# Altium schematic sheet Sheet_2.SchDoc
size A3
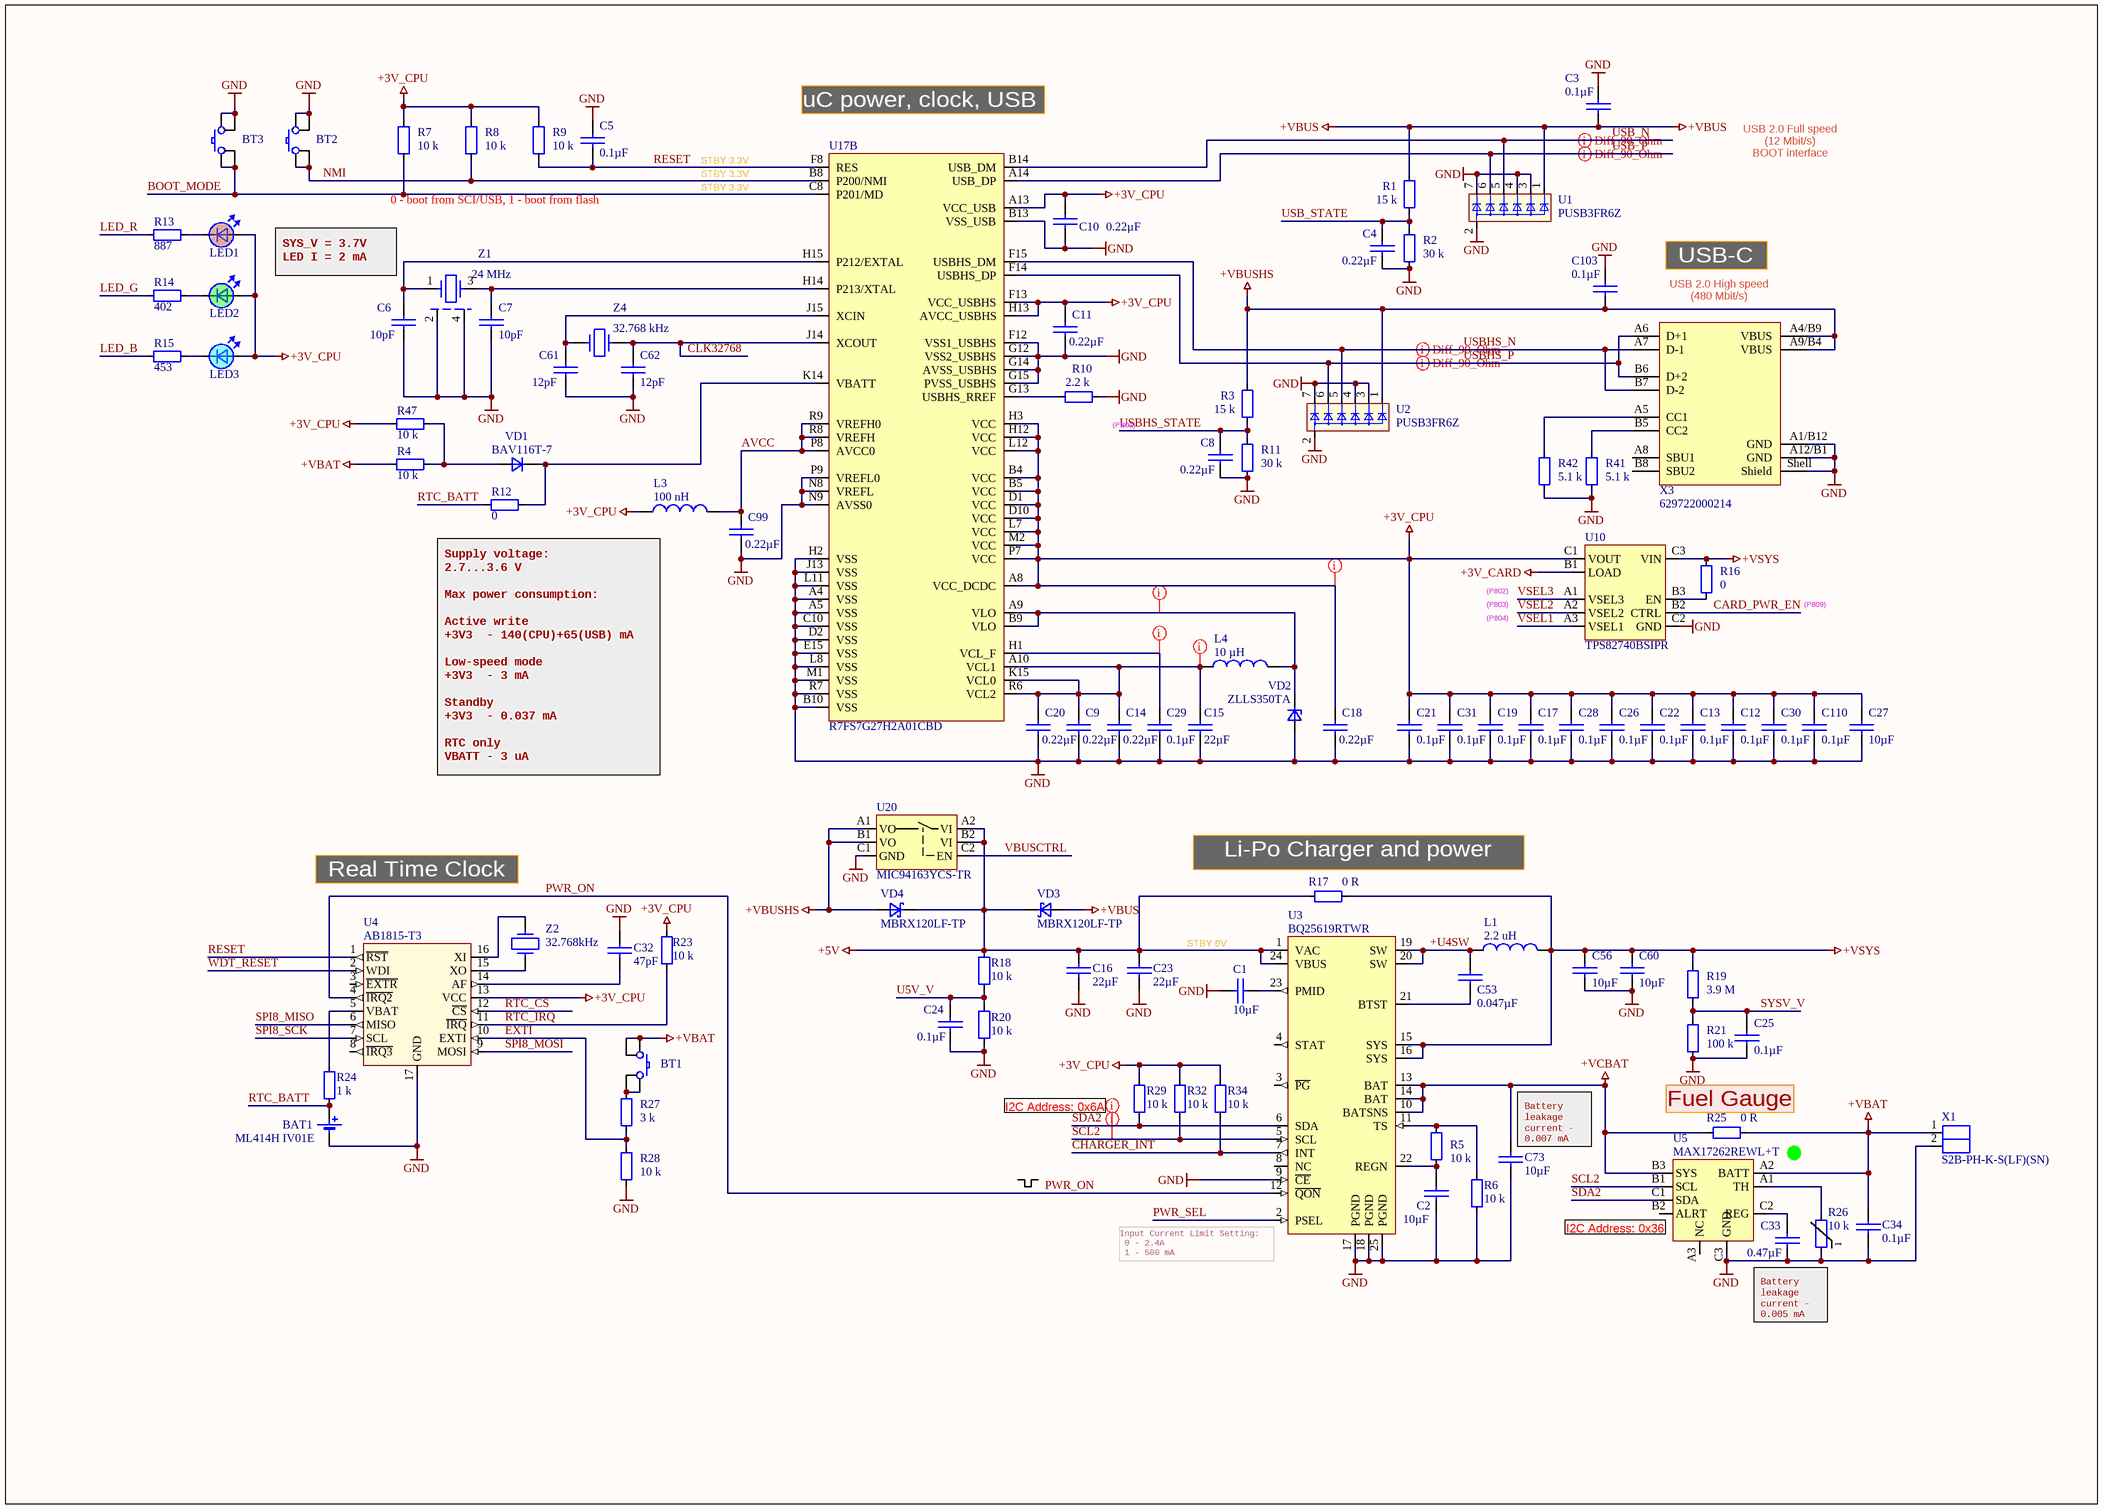
[diagram p0: Sheet_2.SchDoc]

## Parts
BAT1  ML414H IV01E  [ML414H]
BT1  EVP-AVAA1A  [EVPAV]  (value not drawn)
BT2  EVP-AVAA1A  [EVPAV]  (value not drawn)
BT3  EVP-AVAA1A  [EVPAV]  (value not drawn)
C1  value 10µF  [0603 CAP]  (hidden comment: GRT188R61C106KE13D)
C2  value 10µF  [0603 CAP]  (hidden comment: GRT188R61C106KE13D)
C3  value 0.1µF  [0402 CAP]  (hidden comment: 0402B104K500CT)
C4  value 0.22µF  [0402 CAP]  (hidden comment: GRT155R61E224KE01D)
C5  value 0.1µF  [0402 CAP]  (hidden comment: 0402B104K500CT)
C6  value 10pF  [0402 CAP]  (hidden comment: GCM1555C1H100FA16D)
C7  value 10pF  [0402 CAP]  (hidden comment: GCM1555C1H100FA16D)
C8  value 0.22µF  [0402 CAP]  (hidden comment: GRT155R61E224KE01D)
C9  value 0.22µF  [0402 CAP]  (hidden comment: GRT155R61E224KE01D)
C10  value 0.22µF  [0402 CAP]  (hidden comment: GRT155R61E224KE01D)
C11  value 0.22µF  [0402 CAP]  (hidden comment: GRT155R61E224KE01D)
C12  value 0.1µF  [0402 CAP]  (hidden comment: 0402B104K500CT)
C13  value 0.1µF  [0402 CAP]  (hidden comment: 0402B104K500CT)
C14  value 0.22µF  [0402 CAP]  (hidden comment: GRT155R61E224KE01D)
C15  value 22µF  [0402 CAP]  (hidden comment: CL05A226MQ5N6J8)
C16  value 22µF  [0603 CAP]  (hidden comment: LMK107BBJ226MA-T)
C17  value 0.1µF  [0402 CAP]  (hidden comment: 0402B104K500CT)
C18  value 0.22µF  [0402 CAP]  (hidden comment: GRT155R61E224KE01D)
C19  value 0.1µF  [0402 CAP]  (hidden comment: 0402B104K500CT)
C20  value 0.22µF  [0402 CAP]  (hidden comment: GRT155R61E224KE01D)
C21  value 0.1µF  [0402 CAP]  (hidden comment: 0402B104K500CT)
C22  value 0.1µF  [0402 CAP]  (hidden comment: 0402B104K500CT)
C23  value 22µF  [0603 CAP]  (hidden comment: LMK107BBJ226MA-T)
C24  value 0.1µF  [0402 CAP]  (hidden comment: 0402B104K500CT)
C25  value 0.1µF  [0402 CAP]  (hidden comment: 0402B104K500CT)
C26  value 0.1µF  [0402 CAP]  (hidden comment: 0402B104K500CT)
C27  value 10µF  [0603 CAP]  (hidden comment: GRT188R61C106KE13D)
C28  value 0.1µF  [0402 CAP]  (hidden comment: 0402B104K500CT)
C29  value 0.1µF  [0402 CAP]  (hidden comment: 0402B104K500CT)
C30  value 0.1µF  [0402 CAP]  (hidden comment: 0402B104K500CT)
C31  value 0.1µF  [0402 CAP]  (hidden comment: 0402B104K500CT)
C32  value 47pF  [0402 CAP]  (hidden comment: GJM1555C1H470FB01D)
C33  value 0.47µF  [0402 CAP]  (hidden comment: GRT155R61E474ME01D)
C34  value 0.1µF  [0402 CAP]  (hidden comment: 0402B104K500CT)
C53  value 0.047µF  [0402 CAP]  (hidden comment: CC0402KRX7R8BB473)
C56  value 10µF  [0603 CAP]  (hidden comment: GRT188R61C106KE13D)
C60  value 10µF  [0603 CAP]  (hidden comment: GRT188R61C106KE13D)
C61  value 12pF  [0402 CAP]  (hidden comment: 0402N120G500CT)
C62  value 12pF  [0402 CAP]  (hidden comment: 0402N120G500CT)
C73  value 10µF  [0603 CAP]  (hidden comment: GRT188R61C106KE13D)
C99  value 0.22µF  [0402 CAP]  (hidden comment: GRT155R61E224KE01D)
C103  value 0.1µF  [0402 CAP]  (hidden comment: 0402B104K500CT)
C110  value 0.1µF  [0402 CAP]  (hidden comment: 0402B104K500CT)
L1  value 2.2 uH  [IHLP-2020BZ-11]  (hidden comment: IHLP2020BZER2R2M01)
L3  value 100 nH  [INDC1005-0402]  (hidden comment: MLG1005SR10JT000)
L4  value 10 µH  [SRU3017]  (hidden comment: SRU3017-100Y)
LED1  APHHS1005LSECK/J3-PF  [2-SMD RED]  (value not drawn)
LED2  APHHS1005LZGCK-V  [2-SMD GREEN]  (value not drawn)
LED3  APHHS1005LQBC/D-V  [2-SMD BLUE]  (value not drawn)
R1  value 15 k  [0402]  (hidden comment: RMCF0402FT15K0)
R2  value 30 k  [0402]  (hidden comment: RMCF0402FT30K0)
R3  value 15 k  [0402]  (hidden comment: RMCF0402FT15K0)
R4  value 10 k  [0402]  (hidden comment: RMCF0402FT10K0)
R5  value 10 k  [0402]  (hidden comment: RMCF0402FT10K0)
R6  value 10 k  [0402]  (hidden comment: RMCF0402FT10K0)
R7  value 10 k  [0402]  (hidden comment: RMCF0402FT10K0)
R8  value 10 k  [0402]  (hidden comment: RMCF0402FT10K0)
R9  value 10 k  [0402]  (hidden comment: RMCF0402FT10K0)
R10  value 2.2 k  [0402]  (hidden comment: RMCF0402FT2K20)
R11  value 30 k  [0402]  (hidden comment: RMCF0402FT30K0)
R12  value 0  [0402]  (hidden comment: WR04X000 PTL)
R13  value 887  [0402]  (hidden comment: RMCF0402FT887R)
R14  value 402  [0402]  (hidden comment: RMCF0402FT402R)
R15  value 453  [0402]  (hidden comment: RMCF0402FT453R)
R16  value 0  [0402]  (hidden comment: WR04X000 PTL)
R17  value 0 R  [0603]  (hidden comment: RK73Z1JTTD)
R18  value 10 k  [0402]  (hidden comment: RMCF0402FT10K0)
R19  value 3.9 M  [0402]  (hidden comment: CRCW04023M90FKED)
R20  value 10 k  [0402]  (hidden comment: RMCF0402FT10K0)
R21  value 100 k  [0402]  (hidden comment: RC0402FR-07100KL)
R23  value 10 k  [0402]  (hidden comment: RMCF0402FT10K0)
R24  value 1 k  [0402]  (hidden comment: RC0402FR-071KL)
R25  value 0 R  [0603]  (hidden comment: CR0603-10W-000T)
R26  value 10 k  [0402]  (hidden comment: NTCG103JX103DTDS)
R27  value 3 k  [0402]  (hidden comment: RC0402FR-073KL)
R28  value 10 k  [0402]  (hidden comment: RMCF0402FT10K0)
R29  value 10 k  [0402]  (hidden comment: RMCF0402FT10K0)
R32  value 10 k  [0402]  (hidden comment: RMCF0402FT10K0)
R34  value 10 k  [0402]  (hidden comment: RMCF0402FT10K0)
R41  value 5.1 k  [0402]  (hidden comment: RMCF0402FT5K10)
R42  value 5.1 k  [0402]  (hidden comment: RMCF0402FT5K10)
R47  value 10 k  [0402]  (hidden comment: RMCF0402FT10K0)
U1  PUSB3FR6Z  [SOT1358-1]
U2  PUSB3FR6Z  [SOT1358-1]
U3  BQ25619RTWR  [TI S-PVQFN-N24]
U4  AB1815-T3  [QFN-16 3x3mm AB18XX]
U5  MAX17262REWL+T  [9-WFBGA]
U10  TPS82740BSIPR  [MicroSiP]
U17  R7FS7G27H2A01CBD  [RENESAS_FBGA224]  (part B of 2)
U20  MIC94163YCS-TR  [6-BALL WLCSP 1.5x1.0]
VD1  BAV116T-7  [SOD523]
VD2  ZLLS350TA  [SOD523]
VD3  MBRX120LF-TP  [SOD-123]
VD4  MBRX120LF-TP  [SOD-123]
X1  S2B-PH-K-S(LF)(SN)  [S2B-PH-K-S]
X3  629722000214  [629722000214]
Z1  value 24 MHz  [4-SMD 2.00mm x 1.60mm]  (hidden comment: ABM11-24.000MHZ-D2X-T3)
Z2  value 32.768kHz  [ABS7]  (hidden comment: CM315E32768DZZT-4PF)
Z4  value 32.768 kHz  [ABS7]  (hidden comment: ABS07-32.768KHZ-T)

## Nets
+3V_CARD: U10.B1(LOAD)
+3V_CPU: C10.1 C11.1 C12.1 C13.1 C17.1 C18.1 C19.1 C21.1 C22.1 C26.1 C27.1 C28.1 C30.1 C31.1 C110.1 L3.1 LED1.2 LED2.2 LED3.2 R7.2 R8.2 R9.2 R23.1 R29.2 R32.2 R34.2 R47.2 U4.13(VCC) U10.C1(VOUT) U17.A8(VCC_DCDC) U17.A13(VCC_USB) U17.B4(VCC) U17.B5(VCC) U17.D1(VCC) U17.D10(VCC) U17.F13(VCC_USBHS) U17.H3(VCC) U17.H12(VCC) U17.H13(AVCC_USBHS) U17.L7(VCC) U17.L12(VCC) U17.M2(VCC) U17.P7(VCC)
+5V: C16.1 C23.1 R17.1 R18.1 U3.1(VAC) U3.24(VBUS) U20.A2(VI) U20.B2(VI) VD3.1(C) VD4.1(C)
+VBAT: BT1.1 BT1.2 C34.2 R4.2 R25.2 U5.A2(BATT) X1.1
+VBUS: C3.2 R1.1 U1.1 VD3.2(A)
+VBUSHS: C103.2 R3.1 U2.1 U20.A1(VO) U20.B1(VO) VD4.2(A) X3.A4/B9(VBUS) X3.A9/B4(VBUS)
+VCBAT: C73.2 R25.1 U3.10(BATSNS) U3.13(BAT) U3.14(BAT) U5.B3(SYS)
+VSYS: C56.1 C60.1 L1.2 R16.2 R17.2 R19.1 U3.15(SYS) U3.16(SYS) U10.C3(VIN)
GND: BAT1.1 BT2.3 BT2.4 BT3.3 BT3.4 C1.1 C2.2 C3.1 C4.1 C5.2 C6.2 C7.2 C8.1 C9.2 C10.2 C11.2 C12.2 C13.2 C14.2 C15.2 C16.2 C17.2 C18.2 C19.2 C20.2 C21.2 C22.2 C23.2 C24.2 C25.2 C26.2 C27.2 C28.2 C29.2 C30.2 C31.2 C32.2 C33.2 C34.1 C56.2 C60.2 C61.2 C62.2 C73.1 C99.2 C103.1 C110.2 R2.2 R6.1 R10.2 R11.2 R20.2 R21.2 R26.2 R28.1 R41.1 R42.1 U1.2 U1.3 U1.4 U1.7 U2.2 U2.3 U2.4 U2.7 U3.9(~{CE}) U3.17(PGND) U3.18(PGND) U3.25(PGND) U4.17(GND) U5.C3(GND) U10.C2(GND) U17.A4(VSS) U17.A5(VSS) U17.B10(VSS) U17.B13(VSS_USB) U17.C10(VSS) U17.D2(VSS) U17.E15(VSS) U17.F12(VSS1_USBHS) U17.G12(VSS2_USBHS) U17.G14(AVSS_USBHS) U17.G15(PVSS_USBHS) U17.H2(VSS) U17.J13(VSS) U17.L8(VSS) U17.L11(VSS) U17.M1(VSS) U17.N8(VREFL) U17.N9(AVSS0) U17.P9(VREFL0) U17.R7(VSS) U20.C1(GND) VD2.2 X1.2 X3.A1/B12(GND) X3.A12/B1(GND) X3.Shell(Shield) Z1.2 Z1.4
+U4SW: C53.1 L1.1 U3.19(SW) U3.20(SW)
AVCC: C99.1 L3.2 U17.P8(AVCC0) U17.R8(VREFH) U17.R9(VREFH0)
BOOT_MODE: BT3.1 BT3.2 R7.1 U17.C8(P201/MD)
CARD_PWR_EN: U10.B2(CTRL)
CHARGER_INT: R34.1 U3.7(INT)
CLK32768: C62.1 U17.J14(XCOUT) Z4.2
EXTI: R27.1 R28.2 U4.10(EXTI)
LED_B: R15.1
LED_G: R14.1
LED_R: R13.1
NMI: BT2.1 BT2.2 R8.1 U17.B8(P200/NMI)
PWR_ON: U3.12(~{QON}) U4.4(~{IRQ2})
PWR_SEL: U3.2(PSEL)
RESET: C5.1 R9.1 U4.1(~{RST}) U17.F8(RES)
RTC_BATT: BAT1.2 R12.2 R24.1
RTC_CS: U4.12(~{CS})
RTC_IRQ: R23.2 U4.11(~{IRQ})
SCL2: R32.1 U3.5(SCL) U5.B1(SCL)
SDA2: R29.1 U3.6(SDA) U5.C1(SDA)
SPI8_MISO: U4.6(MISO)
SPI8_MOSI: U4.9(MOSI)
SPI8_SCK: U4.7(SCL)
SYSV_V: C25.1 R19.2 R21.1
U5V_V: C24.1 R18.2 R20.1
USB_N: U1.5 U17.B14(USB_DM)
USB_P: U1.6 U17.A14(USB_DP)
USB_STATE: C4.2 R1.2 R2.1
USBHS_N: U2.5 U17.F15(USBHS_DM) X3.A7(D-1) X3.B7(D-2)
USBHS_P: U2.6 U17.F14(USBHS_DP) X3.A6(D+1) X3.B6(D+2)
USBHS_STATE: C8.2 R3.2 R11.1
VBUSCTRL: U20.C2(EN)
VSEL1: U10.A3(VSEL1)
VSEL2: U10.A2(VSEL2)
VSEL3: U10.A1(VSEL3)
WDT_RESET: U4.2(WDI)
NetBT1_3: BT1.3 BT1.4 R27.2
NetC1_2: C1.2 U3.23(PMID)
NetC2_1: C2.1 R5.2 U3.22(REGN)
NetC6_1: C6.1 U17.H15(P212/EXTAL) Z1.1
NetC7_1: C7.1 U17.H14(P213/XTAL) Z1.3
NetC9_1: C9.1 C14.1 C15.1 C20.1 L4.1 U17.A10(VCL1) U17.K15(VCL0) U17.R6(VCL2)
NetC29_1: C29.1 U17.H1(VCL_F)
NetC32_1: C32.1 U4.14(AF)
NetC33_1: C33.1 U5.C2(REG)
NetC53_2: C53.2 U3.21(BTST)
NetC61_1: C61.1 U17.J15(XCIN) Z4.1
NetL4_2: L4.2 U17.A9(VLO) U17.B9(VLO) VD2.1
NetLED1_1: LED1.1 R13.2
NetLED2_1: LED2.1 R14.2
NetLED3_1: LED3.1 R15.2
NetR4_1: R4.1 R47.1 VD1.2(A)
NetR5_1: R5.1 R6.2 U3.11(TS)
NetR10_1: R10.1 U17.G13(USBHS_RREF)
NetR12_1: R12.1 U17.K14(VBATT) VD1.1(C)
NetR16_1: R16.1 U10.B3(EN)
NetR24_2: R24.2 U4.5(VBAT)
NetR26_1: R26.1 U5.A1(TH)
NetR41_2: R41.2 X3.B5(CC2)
NetR42_2: R42.2 X3.A5(CC1)
NetU4_15: U4.15(XO) Z2.1
NetU4_16: U4.16(XI) Z2.2

Not connected (* = marked no-connect by the designer): U3 3(~{PG}) 4(STAT) 8(NC); U4 3(~{EXTR}) 8(~{IRQ3}); U5 A3(NC) B2(ALRT); X3 A8(SBU1) B8(SBU2)

## Layout directives
differential pair; rule Differential Pairs Routing [Pref Gap = 0.127mm    Min Gap  = 0.127mm    Max Gap  = 0.127mmPref Width = 0.143mm    Min Width  = 0.084mm    Max Width  = 0.143mm]: USB_N, USB_P, USBHS_N, USBHS_P
net class CPU_DCDC: +3V_CPU, NetC9_1, NetC29_1, NetL4_2
net class I2C2: SCL2, SDA2

## Notes on the sheet
- uC power, clock, USB
- STBY 3.3V
- USB 2.0 Full speed
  (12 Mbit/s)
  BOOT interface
- 0 - boot from SCI/USB, 1 - boot from flash
- SYS_V = 3.7V
  LED I = 2 mA
- USB 2.0 High speed
  (480 Mbit/s)
- USB-C
- (near R10) (PB01)
- (P804)
- (P803)
- (P802)
- (P809)
- Supply voltage:
  2.7...3.6 V
  Max power consumption:
  Active write
  +3V3  - 140(CPU)+65(USB) mA
  Low-speed mode
  +3V3  - 3 mA
  Standby
  +3V3  - 0.037 mA
  RTC only
  VBATT - 3 uA
- Real Time Clock
- (near R17) Li-Po Charger and power switch
- STBY 0V
- (near R29) I2C Address: 0x6A
- Fuel Gauge
- (near C73) Battery leakage current - 0.007 mA
- (near U3) Input Current Limit Setting:
  0 - 2.4A
  1 - 500 mA
- (near U5) I2C Address: 0x36
- Battery leakage current - 0.005 mA
- (in symbol NTCG103JX103DTDS) t

## Library data of the parts
BAT1 = ML414H IV01E: Coin, 4.8mm 3V Lithium Battery Rechargeable (Secondary) 1mAh; PartNum: 728-1052-1-ND; Manufacturer: Seiko Instruments; Distributor: Digi-Key; PartName: ML414H IV01E
BT1-BT3 = EVP-AVAA1A: Tactile Switch SPST-NO Side Actuated Edge Mount, Right Angle; Manufacturer: Panasonic Electronic Components; PartNum: P16849CT-ND; Distributor: Digi-Key; Price: 0.5$; PartName: EVP-AVAA1A
C1 C2 C27 C56 C60 C73 = GRT188R61C106KE13D: 10µF, ±10%, 16V, X5R, 0603 (1608 Metric), -55°C ~ 85°C, -, Automotive; Manufacturer: Murata Electronics North America; PartNum: 490-12317-1-ND; Voltage - Rated: 16V; Part Number: GRT188R61C106KE13D; Distributor: Digi-Key; PartName: GRT188R61C106KE13D; Price: 0.22770; Tolerance: ±10%; Temperature Coefficient: X5R; Operating Temperature: -55°C ~ 85°C; Features: -; Package / Case: 0603 (1608 Metric)
C3 C5 C12 C13 C17 C19 C21 C22 C24-C26 C28-C31 C34 C103 C110 = 0402B104K500CT: 0.1µF, ±10%, 50V, X7R, 0402 (1005 Metric), -55°C ~ 125°C, -, General Purpose; Manufacturer: Walsin Technology Corporation; PartNum: 1292-1176-1-ND; Voltage - Rated: 50V; Part Number: 0402B104K500CT; Distributor: Digi-Key; PartName: 0402B104K500CT; Price: 0.19000; Tolerance: ±10%; Temperature Coefficient: X7R; Operating Temperature: -55°C ~ 125°C; Features: -; Package / Case: 0402 (1005 Metric)
C4 C8-C11 C14 C18 C20 C99 = GRT155R61E224KE01D: 0.22µF, ±10%, 25V, X5R, 0402 (1005 Metric), -55°C ~ 85°C, -, Automotive; Manufacturer: Murata Electronics North America; PartNum: 490-12265-1-ND; Part Number: GRT155R61E224KE01D; Distributor: Digi-Key; PartName: GRT155R61E224KE01D; Price: 0.11000; Tolerance: ±10%; Voltage - Rated: 25V; Temperature Coefficient: X5R; Operating Temperature: -55°C ~ 85°C; Features: -; Package / Case: 0402 (1005 Metric)
C6 C7 = GCM1555C1H100FA16D: 10pF, ±1%, 50V, C0G, NP0, 0402 (1005 Metric), -55°C ~ 125°C, -, Automotive; Manufacturer: Murata Electronics North America; PartNum: 490-14348-1-ND; Voltage - Rated: 50V; Part Number: GCM1555C1H100FA16D; Distributor: Digi-Key; PartName: GCM1555C1H100FA16D; Price: 0.15000; Tolerance: ±1%; Temperature Coefficient: C0G, NP0; Operating Temperature: -55°C ~ 125°C; Features: -; Package / Case: 0402 (1005 Metric)
C15 = CL05A226MQ5N6J8: 22µF, ±20%, 6.3V, X5R, 0402 (1005 Metric), -55°C ~ 85°C, -, General Purpose; Manufacturer: Samsung Electro-Mechanics; PartNum: 1276-7090-1-ND; Part Number: CL05A226MQ5N6J8; Distributor: Digi-Key; PartName: CL05A226MQ5N6J8; Price: 0.53000; Tolerance: ±20%; Voltage - Rated: 6.3V; Temperature Coefficient: X5R; Operating Temperature: -55°C ~ 85°C; Features: -; Package / Case: 0402 (1005 Metric)
C16 C23 = LMK107BBJ226MA-T: 22µF, ±20%, 10V, X5R, 0603 (1608 Metric), -55°C ~ 85°C, -, SMPS Filtering; Manufacturer: Taiyo Yuden; PartNum: 587-4913-1-ND; Part Number: LMK107BBJ226MA-T; Distributor: Digi-Key; PartName: LMK107BBJ226MA-T; Price: 0.25810; Tolerance: ±20%; Voltage - Rated: 10V; Temperature Coefficient: X5R; Operating Temperature: -55°C ~ 85°C; Features: -; Package / Case: 0603 (1608 Metric)
C32 = GJM1555C1H470FB01D: 47pF, ±1%, 50V, C0G, NP0, 0402 (1005 Metric), -55°C ~ 125°C, High Q, Low Loss, RF, Microwave, High Frequency; Manufacturer: Murata Electronics North America; PartNum: 490-16376-1-ND; Part Number: GJM1555C1H470FB01D; Distributor: Digi-Key; PartName: GJM1555C1H470FB01D; Price: 0.28000; Tolerance: ±1%; Voltage - Rated: 50V; Temperature Coefficient: C0G, NP0; Operating Temperature: -55°C ~ 125°C; Features: High Q, Low Loss; Package / Case: 0402 (1005 Metric)
C33 = GRT155R61E474ME01D: 0.47µF, ±20%, 25V, X5R, 0402 (1005 Metric), -55°C ~ 85°C, -, Automotive; Manufacturer: Murata Electronics North America; PartNum: 490-12270-1-ND; Part Number: GRT155R61E474ME01D; Distributor: Digi-Key; PartName: GRT155R61E474ME01D; Price: 0.13000; Tolerance: ±20%; Voltage - Rated: 25V; Temperature Coefficient: X5R; Operating Temperature: -55°C ~ 85°C; Features: -; Package / Case: 0402 (1005 Metric)
C53 = CC0402KRX7R8BB473: 0.047µF, ±10%, 25V, X7R, 0402 (1005 Metric), -55°C ~ 125°C, -, General Purpose; Manufacturer: Yageo; PartNum: 311-1717-1-ND; Voltage - Rated: 25V; Part Number: CC0402KRX7R8BB473; Distributor: Digi-Key; PartName: CC0402KRX7R8BB473; Price: 0.10000; Tolerance: ±10%; Temperature Coefficient: X7R; Operating Temperature: -55°C ~ 125°C; Features: -; Package / Case: 0402 (1005 Metric)
C61 C62 = 0402N120G500CT: 12pF, ±2%, 50V, C0G, NP0, 0402 (1005 Metric), -55°C ~ 125°C, -, General Purpose; Manufacturer: Walsin Technology Corporation; PartNum: 1292-1250-1-ND; Voltage - Rated: 50V; Part Number: 0402N120G500CT; Distributor: Digi-Key; PartName: 0402N120G500CT; Price: 0.10000; Tolerance: ±2%; Temperature Coefficient: C0G, NP0; Operating Temperature: -55°C ~ 125°C; Features: -; Package / Case: 0402 (1005 Metric)
L1 = IHLP2020BZER2R2M01: 2.2 uH, 4.2 A, 50 mOhms, +-20%,-55.. +125 C; Manufacturer: Vishay Dale; PartNum: 541-1088-1-ND; Tolerance: ±20%; Distributor: Digi-Key; PartName: IHLP2020BZER2R2M01
L3 = MLG1005SR10JT000: 100nH, ±5%, 200 мА, 2 Ohm, 0402, -55..+125 C; Manufacturer: TDK Corporation; PartNum: 445-3071-1-ND; Tolerance: ±5%; Distributor: Digi-Key; PartName: MLG1005SR10JT000
L4 = SRU3017-100Y: 10µH Shielded Wirewound Inductor 850mA 120mOhm Nonstandard, -40...+125 C; Manufacturer: Bourns Inc.; PartNum: SRU3017-100YCT-ND; Tolerance: ±30%; Distributor: Digi-Key; Price: 0.92$; PartName: SRU3017-100Y
LED1 = APHHS1005LSECK/J3-PF: Red 625nm LED Indication - Discrete 1.8V, 2 mA,  0402 (1005 Metric); Manufacturer: Kingbright; PartNum: 754-2123-1-ND; Distributor: Digi-Key; Value: Red; PartName: APHHS1005LSECK/J3-PF
LED2 = APHHS1005LZGCK-V: Green 525nm LED Indication - Discrete 2.65V, 2mA, 0402 (1005 Metric); Manufacturer: Kingbright; PartNum: 754-2126-1-ND; Distributor: Digi-Key; Value: Green; PartName: APHHS1005LZGCK-V
LED3 = APHHS1005LQBC/D-V: Blue 465nm LED Indication - Discrete 2.2V, 2mA, 0402 (1005 Metric); Manufacturer: Kingbright; PartNum: 754-2122-1-ND; Distributor: Digi-Key; Value: Blue; PartName: APHHS1005LQBC/D-V
R1 R3 = RMCF0402FT15K0: 15 kOhms, ±1%, 0.063W, 1/16W, Thick Film, ±100ppm/°C, 0402 (1005 Metric), -55°C ~ 155°C, Automotive AEC-Q200; Manufacturer: Stackpole Electronics Inc; PartNum: RMCF0402FT15K0CT-ND; Voltage: 75V; Distributor: Digi-Key; Price: 0.10000; Tolerance: ±1%; PartName: RMCF0402FT15K0; Part Number: RMCF0402FT15K0; Temperature Coefficient: ±100ppm/°C; Operating Temperature: -55°C ~ 155°C; Power (Watts): 0.063W, 1/16W; Features: Automotive AEC-Q200; Package / Case: 0402 (1005 Metric)
R2 R11 = RMCF0402FT30K0: 30 kOhms, ±1%, 0.063W, 1/16W, Thick Film, ±100ppm/°C, 0402 (1005 Metric), -55°C ~ 155°C, Automotive AEC-Q200; Manufacturer: Stackpole Electronics Inc; PartNum: RMCF0402FT30K0CT-ND; Voltage: 75V; Distributor: Digi-Key; Price: 0.10000; Tolerance: ±1%; PartName: RMCF0402FT30K0; Part Number: RMCF0402FT30K0; Temperature Coefficient: ±100ppm/°C; Operating Temperature: -55°C ~ 155°C; Power (Watts): 0.063W, 1/16W; Features: Automotive AEC-Q200; Package / Case: 0402 (1005 Metric)
R4-R9 R18 R20 R23 R28 R29 R32 R34 R47 = RMCF0402FT10K0: 10 kOhms, ±1%, 0.063W, 1/16W, Thick Film, ±100ppm/°C, 0402 (1005 Metric), -55°C ~ 155°C, Automotive AEC-Q200; Manufacturer: Stackpole Electronics Inc; PartNum: RMCF0402FT10K0CT-ND; Voltage: 75V; Distributor: Digi-Key; Price: 0.10000; Tolerance: ±1%; PartName: RMCF0402FT10K0; Part Number: RMCF0402FT10K0; Temperature Coefficient: ±100ppm/°C; Operating Temperature: -55°C ~ 155°C; Power (Watts): 0.063W, 1/16W; Features: Automotive AEC-Q200; Package / Case: 0402 (1005 Metric)
R10 = RMCF0402FT2K20: 2.2 kOhms, ±1%, 0.063W, 1/16W, Thick Film, ±100ppm/°C, 0402 (1005 Metric), -55°C ~ 155°C, Automotive AEC-Q200; Manufacturer: Stackpole Electronics Inc; PartNum: RMCF0402FT2K20CT-ND; Voltage: 75V; Distributor: Digi-Key; Price: 0.10000; Tolerance: ±1%; PartName: RMCF0402FT2K20; Part Number: RMCF0402FT2K20; Temperature Coefficient: ±100ppm/°C; Operating Temperature: -55°C ~ 155°C; Power (Watts): 0.063W, 1/16W; Features: Automotive AEC-Q200; Package / Case: 0402 (1005 Metric)
R12 R16 = WR04X000 PTL: 0 Ohms Jumper 0.063W, 1/16W Chip Resistor 0402 (1005 Metric) Thick Film; Manufacturer: Walsin Technology Corporation; PartNum: 1292-WR04X000PTLCT-ND; Voltage: 50 V; Distributor: Digi-Key; Price: 0.002$; PartName: WR04X000 PTL
R13 = RMCF0402FT887R: 887 Ohms, ±1%, 0.063W, 1/16W, Thick Film, ±100ppm/°C, 0402 (1005 Metric), -55°C ~ 155°C, Automotive AEC-Q200; Manufacturer: Stackpole Electronics Inc; PartNum: RMCF0402FT887RCT-ND; Voltage: 75V; Distributor: Digi-Key; Price: 0.10000; Tolerance: ±1%; PartName: RMCF0402FT887R; Part Number: RMCF0402FT887R; Temperature Coefficient: ±100ppm/°C; Operating Temperature: -55°C ~ 155°C; Power (Watts): 0.063W, 1/16W; Features: Automotive AEC-Q200; Package / Case: 0402 (1005 Metric)
R14 = RMCF0402FT402R: 402 Ohms, ±1%, 0.063W, 1/16W, Thick Film, ±100ppm/°C, 0402 (1005 Metric), -55°C ~ 155°C, Automotive AEC-Q200; Manufacturer: Stackpole Electronics Inc; PartNum: RMCF0402FT402RCT-ND; Voltage: 75V; Distributor: Digi-Key; Price: 0.10000; Tolerance: ±1%; PartName: RMCF0402FT402R; Part Number: RMCF0402FT402R; Temperature Coefficient: ±100ppm/°C; Operating Temperature: -55°C ~ 155°C; Power (Watts): 0.063W, 1/16W; Features: Automotive AEC-Q200; Package / Case: 0402 (1005 Metric)
R15 = RMCF0402FT453R: 453 Ohms, ±1%, 0.063W, 1/16W, Thick Film, ±100ppm/°C, 0402 (1005 Metric), -55°C ~ 155°C, Automotive AEC-Q200; Manufacturer: Stackpole Electronics Inc; PartNum: RMCF0402FT453RCT-ND; Voltage: 75V; Distributor: Digi-Key; Price: 0.10000; Tolerance: ±1%; PartName: RMCF0402FT453R; Part Number: RMCF0402FT453R; Temperature Coefficient: ±100ppm/°C; Operating Temperature: -55°C ~ 155°C; Power (Watts): 0.063W, 1/16W; Features: Automotive AEC-Q200; Package / Case: 0402 (1005 Metric)
R17 = RK73Z1JTTD: 0 Ohms Jumper Chip Resistor 0603 (1608 Metric) Automotive AEC-Q200, Moisture Resistant Metal Element, -55°C ~ 155°C; Manufacturer: KOA Speer Electronics, Inc.; PartNum: 2019-RK73Z1JTTDCT-ND; Distributor: Digi-Key; Price: 0.007$; PartName: RK73Z1JTTD
R19 = CRCW04023M90FKED: 3.9 MOhms, ±1%, 0.063W, 1/16W, Thick Film, ±100ppm/°C, 0402 (1005 Metric), -55°C ~ 155°C, Automotive AEC-Q200; Manufacturer: Vishay Dale; PartNum: 541-3.90MLCT-ND; Voltage: 75V; Distributor: Digi-Key; Price: 0.10000; Tolerance: ±1%; PartName: CRCW04023M90FKED; Part Number: CRCW04023M90FKED; Temperature Coefficient: ±100ppm/°C; Operating Temperature: -55°C ~ 155°C; Power (Watts): 0.063W, 1/16W; Features: Automotive AEC-Q200; Package / Case: 0402 (1005 Metric)
R21 = RC0402FR-07100KL: 100 kOhms, ±1%, 0.063W, 1/16W, Thick Film, ±100ppm/°C, 0402 (1005 Metric), -55°C ~ 155°C, Moisture Resistant; Manufacturer: Yageo; PartNum: 311-100KLRCT-ND; Voltage: 75V; Distributor: Digi-Key; Price: 0.10000; Tolerance: ±1%; PartName: RC0402FR-07100KL; Part Number: RC0402FR-07100KL; Temperature Coefficient: ±100ppm/°C; Operating Temperature: -55°C ~ 155°C; Power (Watts): 0.063W, 1/16W; Features: Moisture Resistant; Package / Case: 0402 (1005 Metric)
R24 = RC0402FR-071KL: 1 kOhms, ±1%, 0.063W, 1/16W, Thick Film, ±100ppm/°C, 0402 (1005 Metric), -55°C ~ 155°C, Moisture Resistant; Manufacturer: Yageo; PartNum: 311-1.00KLRCT-ND; Voltage: 75V; Distributor: Digi-Key; Price: 0.10000; Tolerance: ±1%; PartName: RC0402FR-071KL; Part Number: RC0402FR-071KL; Temperature Coefficient: ±100ppm/°C; Operating Temperature: -55°C ~ 155°C; Power (Watts): 0.063W, 1/16W; Features: Moisture Resistant; Package / Case: 0402 (1005 Metric)
R25 = CR0603-10W-000T: 0 Ohms Jumper 0.1W, 1/10W Chip Resistor 0603 (1608 Metric) - Thick Film; Manufacturer: Venkel; PartNum: 2679-CR0603-10W-000TTR-ND; Voltage: 75 V; Distributor: Digi-Key; Price: 0.005$; PartName: CR0603-10W-000T
R26 = NTCG103JX103DTDS: NTC Thermistor 10k , B25/85=3435K,  -40°C ~ 125°C; Manufacturer: TDK Corporation; PartNum: 445-174509-1-ND; Tolerance: ±0.5%; Distributor: Digi-Key; Price: 0.54$; PartName: NTCG103JX103DTDS
R27 = RC0402FR-073KL: 3 kOhms, ±1%, 0.063W, 1/16W, Thick Film, ±100ppm/°C, 0402 (1005 Metric), -55°C ~ 155°C, Moisture Resistant; Manufacturer: Yageo; PartNum: 311-3KLRCT-ND; Voltage: 75V; Distributor: Digi-Key; Price: 0.10000; Tolerance: ±1%; PartName: RC0402FR-073KL; Part Number: RC0402FR-073KL; Temperature Coefficient: ±100ppm/°C; Operating Temperature: -55°C ~ 155°C; Power (Watts): 0.063W, 1/16W; Features: Moisture Resistant; Package / Case: 0402 (1005 Metric)
R41 R42 = RMCF0402FT5K10: 5.1 kOhms, ±1%, 0.063W, 1/16W, Thick Film, ±100ppm/°C, 0402 (1005 Metric), -55°C ~ 155°C, Automotive AEC-Q200; Manufacturer: Stackpole Electronics Inc; PartNum: RMCF0402FT5K10CT-ND; Voltage: 75V; Distributor: Digi-Key; Price: 0.10000; Tolerance: ±1%; PartName: RMCF0402FT5K10; Part Number: RMCF0402FT5K10; Temperature Coefficient: ±100ppm/°C; Operating Temperature: -55°C ~ 155°C; Power (Watts): 0.063W, 1/16W; Features: Automotive AEC-Q200; Package / Case: 0402 (1005 Metric)
U1 U2 = PUSB3FR6Z: TVS Diode, 3V (Typ) Clamp 5A (8/20µs) Ipp ,  7-XSON (1.1x2.1), -40°C ~ 85°C (TA); Manufacturer: Nexperia USA Inc.; PartNum: 1727-2027-1-ND; Voltage: 3.3 V; Distributor: Digi-Key; Price: 0.41$; PartName: PUSB3FR6Z; Supplier 1: Arrow Electronics; Supplier Part Number 1: PUSB3FR6Z
U3 = BQ25619RTWR: Charger IC Lithium Ion/Polymer 24-WQFN (4x4), -40...+85 C; PartNum: 296-BQ25619RTWRCT-ND; Manufacturer: Texas Instruments; PartName: BQ25619RTWR; Distributor: Digi-Key; Price: 3.48$; Supplier 1: Mouser; Supplier Part Number 1: 595-BQ25619RTWR
U4 = AB1815-T3: Real Time Clock (RTC) IC Clock/Calendar 256B SPI, 16-VFQFN Exposed Pad, -40...+85 C; Manufacturer: Abracon LLC; PartNum: 535-11936-1-ND; Price: 1.85$; Distributor: Digi-Key; PartName: AB1815-T3; Supplier 1: Arrow Electronics; Supplier Part Number 1: AB1815-T3
U5 = MAX17262REWL+T: Battery Fuel Gauge IC LiFePO4/Li-ion 9-WLP, -40°C ~ 85°C (TA); Manufacturer: Analog Devices Inc./Maxim Integrated; PartNum: 175-MAX17262REWL+TCT-ND; Distributor: Digi-Key; Price: 2.12$; PartName: MAX17262REWL+T; Supplier 1: Digi-Key; Supplier Part Number 1: 175-MAX17262REWL+TCT-ND
U10 = TPS82740BSIPR: Non-Isolated PoL Module DC DC Converter 1 Output 2.6 ~ 3.3V 200mA 2.2V - 5.5V Input, 3.0mm x 2.4mm x 1.0mm, -40...85 C; Manufacturer: Texas Instruments; PartNum: 296-46481-1-ND; Distributor: Digi-Key; price: 2.88$; PartName: TPS82740BSIPR; Supplier 1: Arrow Electronics; Supplier Part Number 1: TPS82740BSIPR
U17 = R7FS7G27H2A01CBD#AC0: Manufacturer: Renesas; PartNum: R7FS7G27H2A01CBD#AC0-ND; Distributor: Digi-Key; PartName: R7FS7G27H2A01CBD#AC0; Price: 24$
U20 = MIC94161YCS-TR: Power Switch/Driver 1:1 P-Channel 3A, 14.5mOhm,  6-WLCSP (1x1.5), -40°C ~ 125°C (TJ); Manufacturer: Microchip Technology; PartNum: 576-4454-1-ND; Distributor: Digi-Key; Price: 0.46$; PartName: MIC94163YCS-TR; Supplier 1: Digi-Key; Supplier Part Number 1: 576-4453-1-ND
VD1 = BAV116T-7: Diode Standard 85V 100mA, 5nA @ 75V, SOD-523, -65°C ~ 150°C; Manufacturer: Diodes Incorporated; PartNum: BAV116T-7DICT-ND; Distributor: Digi-Key; Price: 0.24$; PartName: BAV116T-7
VD2 = ZLLS350TA: Diode Schottky 40V 380mA (DC) , Fast Recovery, SOD-523; Manufacturer: Diodes Incorporated; PartNum: ZLLS350TACT-ND; Price: 043$; Distributor: Digi-Key; PartName: ZLLS350TA; Voltage: 40V
VD3 VD4 = MBRX120LF-TP: Diode Schottky 20 V 1A, 360 mV @ 1 A ,  Surface Mount SOD-123, -65°C ~ 125°C; Manufacturer: Micro Commercial Co; PartNum: MBRX120LF-TPMSCT-ND; Price: 0.2$; Distributor: Digi-Key; PartName: MBRX120LF-TP
X1 = S2B-PH-K-S(LF)(SN): Connector Header Through Hole, Right Angle 2 position 0.079" (2.00mm); Manufacturer: JST Sales America Inc.; PartNum: 455-1719-ND; Distributor: Digi-Key; Price: 0.1$; PartName: S2B-PH-K-S(LF)(SN)
X3 = 629722000214: WR-USB 2.0 Type C, Receptacle, Horizontal, SMT; Manufacturer: Wurth Elektronik; Interface Type: Type C; Number of Ports: 1; Rated Current: 5A; Working Voltage: 20VAC; ComponentLink1Description: Website Link; ComponentLink1URL: https://www.we-online.com/redexpert/article/629722000214?ad; ComponentLink2Description: Datasheet Link; ComponentLink2URL: https://www.we-online.com/redexpert/spec/629722000214?ad; Manufacturer Part Number: 629722000214; Category: Input/Output Connectors; Match Code: WR-USB; Mount: Surface Mount; Operating Temperature Max: 85°C; Operating Temperature Min: -40°C; Packaging: Tape and Reel; Application: USB 2.0; Gender: Receptacle; Number of Pins: 16; Orientation: Horizontal
Z1 = ABM11-24.000MHZ-D2X-T3: 24 MHz, 10 pF, ±20ppm, 2.00mm x 1.60mm, -40°C ~ 85°C; Manufacturer: Abracon LLC; PartNum: 535-10940-1-ND; Price: 1.36 $; Distributor: Digi-Key; Tolerance: 20 ppm; PartName: ABM11-24.000MHZ-D2X-T3
Z2 = CM315E32768DZZT-4PF: 32.768 kHz ±20ppm Crystal 4pF 70 kOhms 3-SMD, No Lead, 3.20mm x 1.50mm, -40°C ~ 85°C; Manufacturer: Citizen Finedevice Co Ltd; PartNum: 300-8868-1-ND; Price: 0.62$; Distributor: Digi-Key; Tolerance: ±20ppm; PartName: CM315E32768DZZT-4PF
Z4 = ABS07-32.768KHZ-T: 32.768 kHz, 12.5 pF, 70 kOhm, ±20ppm, 3.2 x 1.5 mm, -40°C ~ 85°C; Manufacturer: Abracon Corporation; PartNum: 535-9542-1-ND; Price: 1.09$; Distributor: Digi-Key; Tolerance: 20 ppm; PartName: ABS07-32.768KHZ-T